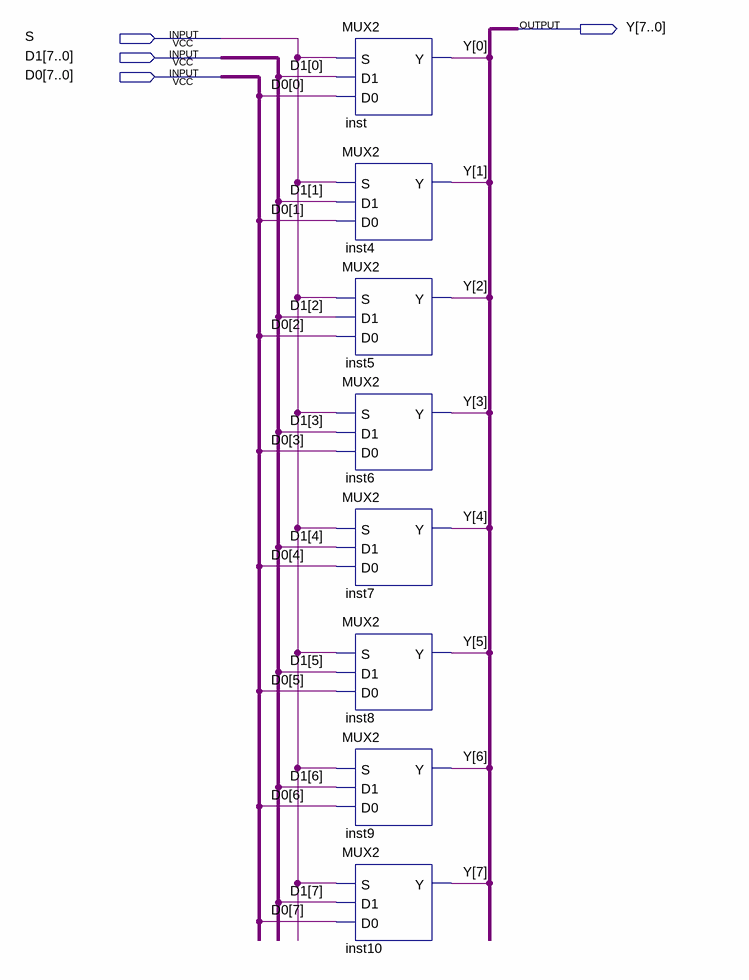
[diagram p0: schematic sheet]
// Quartus schematic mux2_8bit.bdf as structural Verilog: 8 symbols, 4 pins
module mux2_8bit (
  input  S,
  input  [7:0] D1,
  input  [7:0] D0,
  output [7:0] Y
);

  MUX2 inst (.S(S), .D1(D1[0]), .D0(D0[0]), .Y(Y[0]));
  MUX2 inst4 (.S(S), .D1(D1[1]), .D0(D0[1]), .Y(Y[1]));
  MUX2 inst5 (.S(S), .D1(D1[2]), .D0(D0[2]), .Y(Y[2]));
  MUX2 inst6 (.S(S), .D1(D1[3]), .D0(D0[3]), .Y(Y[3]));
  MUX2 inst7 (.S(S), .D1(D1[4]), .D0(D0[4]), .Y(Y[4]));
  MUX2 inst8 (.S(S), .D1(D1[5]), .D0(D0[5]), .Y(Y[5]));
  MUX2 inst9 (.S(S), .D1(D1[6]), .D0(D0[6]), .Y(Y[6]));
  MUX2 inst10 (.S(S), .D1(D1[7]), .D0(D0[7]), .Y(Y[7]));
endmodule
